# EAGLE schematic Complete Project Schematic (EAGLE 9.6.2)
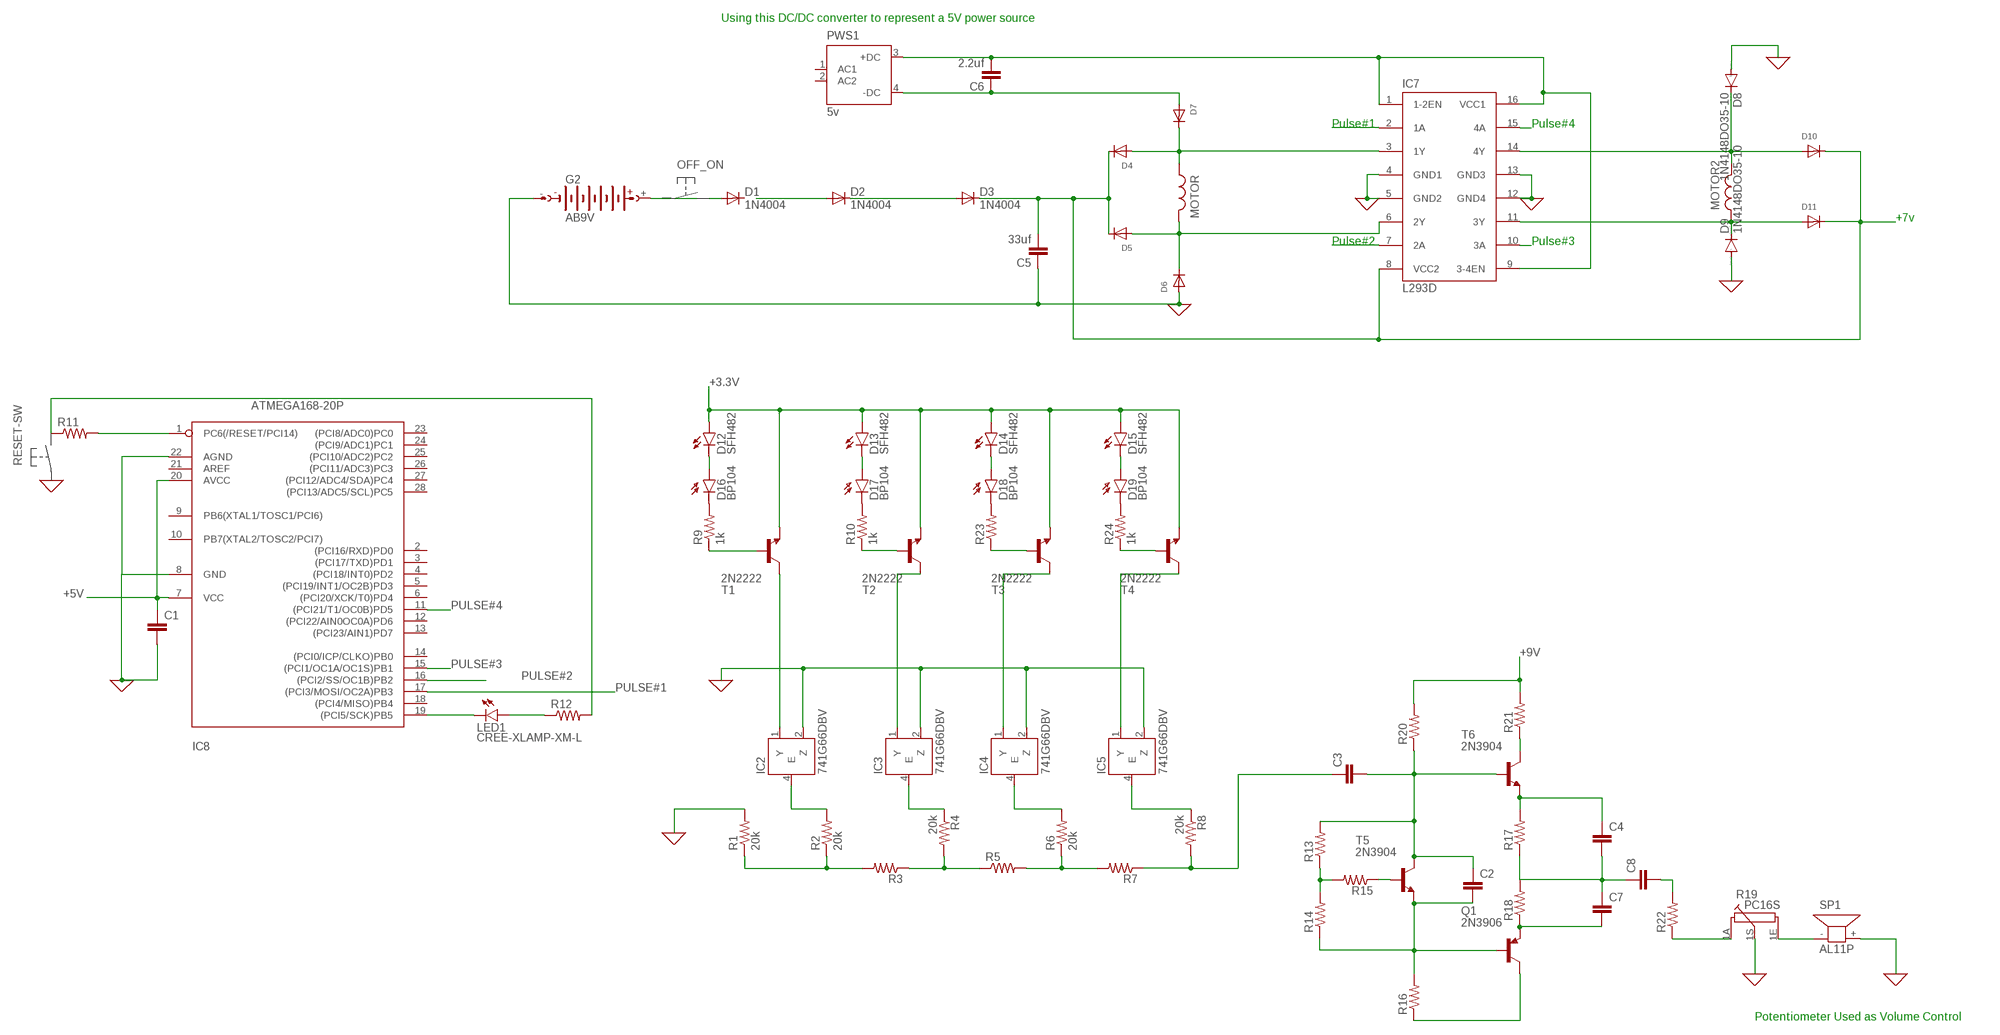
[diagram p0: schematic, sheet 1]

## Parts
C1  C2,5-3  [C2.5-3]
C2  C2,5-3  [C2.5-3]
C3  C2,5-3  [C2.5-3]
C4  C2,5-3  [C2.5-3]
C5  33uf  C2,5-3  [C2.5-3]
C6  2.2uf  C2,5-3  [C2.5-3]
C7  C2,5-3  [C2.5-3]
C8  C2,5-3  [C2.5-3]
D1  1N4004  [DO41-10]
D2  1N4004  [DO41-10]
D3  1N4004  [DO41-10]
D4  DIODEDO-1N4148  [DO-1N4148]
D5  DIODEDO-1N4148  [DO-1N4148]
D6  DIODEDO-1N4148  [DO-1N4148]
D7  DIODEDO-1N4148  [DO-1N4148]
D8  1N4148DO35-10  [DO35-10]
D9  1N4148DO35-10  [DO35-10]
D10  DIODEDO-1N4148  [DO-1N4148]
D11  DIODEDO-1N4148  [DO-1N4148]
D12  SFH482  [SFH482]
D13  SFH482  [SFH482]
D14  SFH482  [SFH482]
D15  SFH482  [SFH482]
D16  BP104  [BP104]
D17  BP104  [BP104]
D18  BP104  [BP104]
D19  BP104  [BP104]
G2  AB9V  [AB9V]
IC2  741G66DBV  [SOT23-5]
IC3  741G66DBV  [SOT23-5]
IC4  741G66DBV  [SOT23-5]
IC5  741G66DBV  [SOT23-5]
IC7  L293D  [DIL16]
IC8  ATMEGA168-20P  [DIL28-3]
LED1  CREE-XLAMP-XM-L  [CREE-XLAMP-XM-L]
MOTOR  L  (no package)
MOTOR2  L  (no package)
PWS1  5v  TPM_05105  [05105]
Q1  2N3906  [TO92]
R1  20k  R-US_0204/5  [0204/5]
R2  20k  R-US_0204/5  [0204/5]
R3  R-US_0204/5  [0204/5]
R4  20k  R-US_0204/5  [0204/5]
R5  R-US_0204/5  [0204/5]
R6  20k  R-US_0204/5  [0204/5]
R7  R-US_0204/5  [0204/5]
R8  20k  R-US_0204/5  [0204/5]
R9  1k  R-US_0204/2V  [0204V]
R10  1k  R-US_0204/2V  [0204V]
R11  R-US_0204/2V  [0204V]
R12  R-US_0204/2V  [0204V]
R13  R-US_0204/2V  [0204V]
R14  R-US_0204/2V  [0204V]
R15  R-US_0204/2V  [0204V]
R16  R-US_0204/2V  [0204V]
R17  R-US_0204/2V  [0204V]
R18  R-US_0204/2V  [0204V]
R19  PC16S  [PC16S]
R20  R-US_0204/2V  [0204V]
R21  R-US_0204/2V  [0204V]
R22  R-US_0204/2V  [0204V]
R23  R-US_0204/2V  [0204V]
R24  1k  R-US_0204/2V  [0204V]
SP1  AL11P  [AL11P]
T1  2N2222  [TO18]
T2  2N2222  [TO18]
T3  2N2222  [TO18]
T4  2N2222  [TO18]
T5  2N3904  [TO92]
T6  2N3904  [TO92]

## Nets
0: C1.2 C5.1 D6.A D8.A D9.A G2.- IC2.2(Z) IC3.2(Z) IC4.2(Z) IC5.2(Z) IC7.4(GND1) IC7.5(GND2) IC7.12(GND4) IC7.13(GND3) IC8.8(GND) IC8.22(AGND) R1.2 R19.1S SP1.+ ; supply symbol labelled GND
+3.3V: D12.A D13.A D14.A D15.A T1.1(E) T2.1(E) T3.1(E) T4.1(E)
+5V: C1.1 IC8.7(VCC) IC8.20(AVCC)
+9V: R20.2 R21.2
N$1: IC7.2(1A)
N$2: R1.1 R2.1 R3.2
N$3: R3.1 R4.2 R5.1
N$4: R5.2 R6.1 R7.2
N$5: C3.1 R7.1 R8.2
N$6: IC2.4(E) R2.2
N$7: IC3.4(E) R4.1
N$8: IC4.4(E) R6.2
N$9: IC5.4(E) R8.1
N$10: D16.K(C) R9.2
N$11: IC7.15(4A)
N$12: IC4.1(Y) T3.3(C)
N$13: IC7.10(3A)
N$14: IC7.7(2A)
N$15: C6.2 IC7.1(1-2EN) IC7.9(3-4EN) IC7.16(VCC1) PWS1.3(+DC)
N$16: D8.C D10.A IC7.14(4Y) MOTOR2.2
N$17: D9.C D11.A IC7.11(3Y) MOTOR2.1
N$18: IC8.1(PC6(/RESET/PCI14)) R11.2
N$19: R19.1E SP1.-
N$20: R11.1 R12.2
N$21: LED1.A LED1.A@1(A) R12.1
N$22: IC8.19((PCI5/SCK)PB5) LED1.C LED1.C@1(C)
N$23: D4.A D7.C IC7.3(1Y) MOTOR.1
N$24: R13.1 R14.2 R15.2
N$25: R9.1 T1.2(B)
N$26: D1.A G2.+
N$27: D2.A
N$28: D2.C D3.A
N$29: C5.2 D3.C D4.C D5.C D10.C D11.C IC7.8(VCC2)
N$30: R24.1 T4.2(B)
N$31: R23.1 T3.2(B)
N$32: D5.A D6.C IC7.6(2Y) MOTOR.2
N$33: C6.1 D7.A PWS1.4(-DC)
N$34: R10.1 T2.2(B)
N$35: R15.1 T5.2(B)
N$36: C2.1 C3.2 R13.2 R20.1 T5.1(C) T6.2(B)
N$37: C2.2 Q1.2(B) R14.1 R16.2 T5.3(E)
N$38: D17.K(C) R10.2
N$39: R21.1 T6.1(C)
N$40: C4.1 R17.2 T6.3(E)
N$41: C8.2 R22.2
N$42: C7.2 Q1.3(E) R18.1
N$43: Q1.1(C) R16.1
N$44: C4.2 C7.1 C8.1 R17.1 R18.2
N$45: IC2.1(Y) T1.3(C)
N$46: IC3.1(Y) T2.3(C)
N$47: IC5.1(Y) T4.3(C)
N$48: D18.K(C) R23.2
N$49: R19.1A R22.1
N$50: D19.K(C) R24.2
N$51: D12.K(C) D16.A
N$52: D13.K(C) D17.A
N$53: D14.K(C) D18.A
N$54: D15.K(C) D19.A
PULSE#1: IC8.17((PCI3/MOSI/OC2A)PB3)
PULSE#2: IC8.16((PCI2/SS/OC1B)PB2)
PULSE#3: IC8.15((PCI1/OC1A/OC1S)PB1)
PULSE#4: IC8.11((PCI21/T1/OC0B)PD5)
Unconnected: D1.C IC8.2((PCI16/RXD)PD0) IC8.3((PCI17/TXD)PD1) IC8.4((PCI18/INT0)PD2) IC8.5((PCI19/INT1/OC2B)PD3) IC8.6((PCI20/XCK/T0)PD4) IC8.9(PB6(XTAL1/TOSC1/PCI6)) IC8.10(PB7(XTAL2/TOSC2/PCI7)) IC8.12((PCI22/AIN0OC0A)PD6) IC8.13((PCI23/AIN1)PD7) IC8.14((PCI0/ICP/CLKO)PB0) IC8.18((PCI4/MISO)PB4) IC8.21(AREF) IC8.23((PCI8/ADC0)PC0) IC8.24((PCI9/ADC1)PC1) IC8.25((PCI10/ADC2)PC2) IC8.26((PCI11/ADC3)PC3) IC8.27((PCI12/ADC4/SDA)PC4) IC8.28((PCI13/ADC5/SCL)PC5) PWS1.1(AC1) PWS1.2(AC2)

## Notes on the sheet
- Using this DC/DC converter to represent a 5V power source
- Pulse#1 | Pulse#4
- +7v
- Pulse#2 | Pulse#3
- Potentiometer Used as Volume Control

## Power pins joined to a net without a drawn wire
GND: IC2.3(GND) IC3.3(GND) IC4.3(GND) IC5.3(GND)
VCC: IC2.5(VCC) IC3.5(VCC) IC4.5(VCC) IC5.5(VCC)

## Library data of the parts
C1-C8 = capacitor-wima:C: CAPACITOR naming: grid - package width
D1-D3 = adafruit:1N4004: DIODE General purpose 1N400x type rectifier (With bigger pads) http://www.ladyada.net/library/pcb/eaglelibrary.html
D4-D7 D10 D11 = adafruit:DIODE: Diode SMADIODE - SMA Surface Mount Package 20V 1A Schottky Diode Digikey: 641-1014-6-ND DO-1N4148 - Through Hole Small Current Diode SOD-123 20V 1 A (.5mV Vf) Schottky Diode - Digikey: MBRX120TPMSCT-ND SOD-323 10V 570mA (.38mV Vf, 3ns) Schottky Diode - Digikey: ZLLS410CT-ND SOD-523 30V 30mA Schottky Diode (RB751S-40TE61) - Digikey: RB751S-40TE61CT-ND SOT23-R/W - SOT23 Package (R = Solder Paste/Reflow Ovens, W = Hand-Soldering) BAT54Film 40V 300mA - Digikey: 497-7162-1-ND
D8 D9 = diode:1N4148: DIODE high speed (Philips)
D12-D15 = led:SFH482: IR LED infrared emitting diode, Infineon
D16-D19 = opto-trans-siemens:BP104: PHOTO DIODE; MF: VISHAY/TELEFUNKEN; MPN: BP104; OC_FARNELL: 1779636; OC_NEWARK: 14M4504
G2 = battery:AB9V: 9-V BATTERY CLIP
IC2-IC5 = 74xx-little-us:74*1G66: Single Analog / Bilateral Switch Source: http://www.semiconductors.philips.com/acrobat_download/datasheets/74HC_HCT1G66_3.pdf
IC7 = st-microelectronics:L293D: PUSH-PULL 4 CHANNEL DRIVER; MPN: L293D; OC_FARNELL: 9589619; OC_NEWARK: 56P8249
IC8 = adafruit:ATMEGA168*P: MICROCONTROLLER 16 kBytes FLASH 1 kBytes SRAM 512 Bytes EEPROM USART 8-channel 10 bit ADC
LED1 = led:CREE-XLAMP-XM-L: Cree® XLamp® XM-L LEDs Source: http://www.cree.com
MOTOR MOTOR2 = ngspice-simulation:L: INDUCTOR
PWS1 = traco-electronic:TPM_*: DC/DC Konverter 5 Watt, 1 x Input, 1 x Output Source: http://www.tracopower.com/datasheet_g/tpm-d.pdf; OC_FARNELL: unknown; OC_NEWARK: unknown
Q1 = transistor-pnp:2N3906: PNP Transistor
R1-R8 = rcl:R-US_: RESISTOR, American symbol; SPICEPREFIX: R
R9-R18 R20-R24 = adafruit:R-US_: RESISTOR, American symbol
R19 = piher:PC16S: POTENTIOMETER single carbon potentiometer, 16 mm, S3ROH; OC_FARNELL: 4452940; OC_NEWARK: unknown
SP1 = buzzer:AL11P: SPEAKER Source: Buerklin; OC_FARNELL: unknown; OC_NEWARK: unknown
T1-T4 = transistor:2N2222: NPN TRANSISTOR
T5 T6 = transistor:2N3904: NPN TRANSISTOR

## Module VOLTAGE_SUPPLY
Ports: 

### Library data of the parts